# EasyEDA schematic Schematic.json
TITLE: Sheet_1; REV: 1.0; Date: 2023-12-07; Sheet: 1/1; Drawn By: superepicrafter360; Company: Your Company
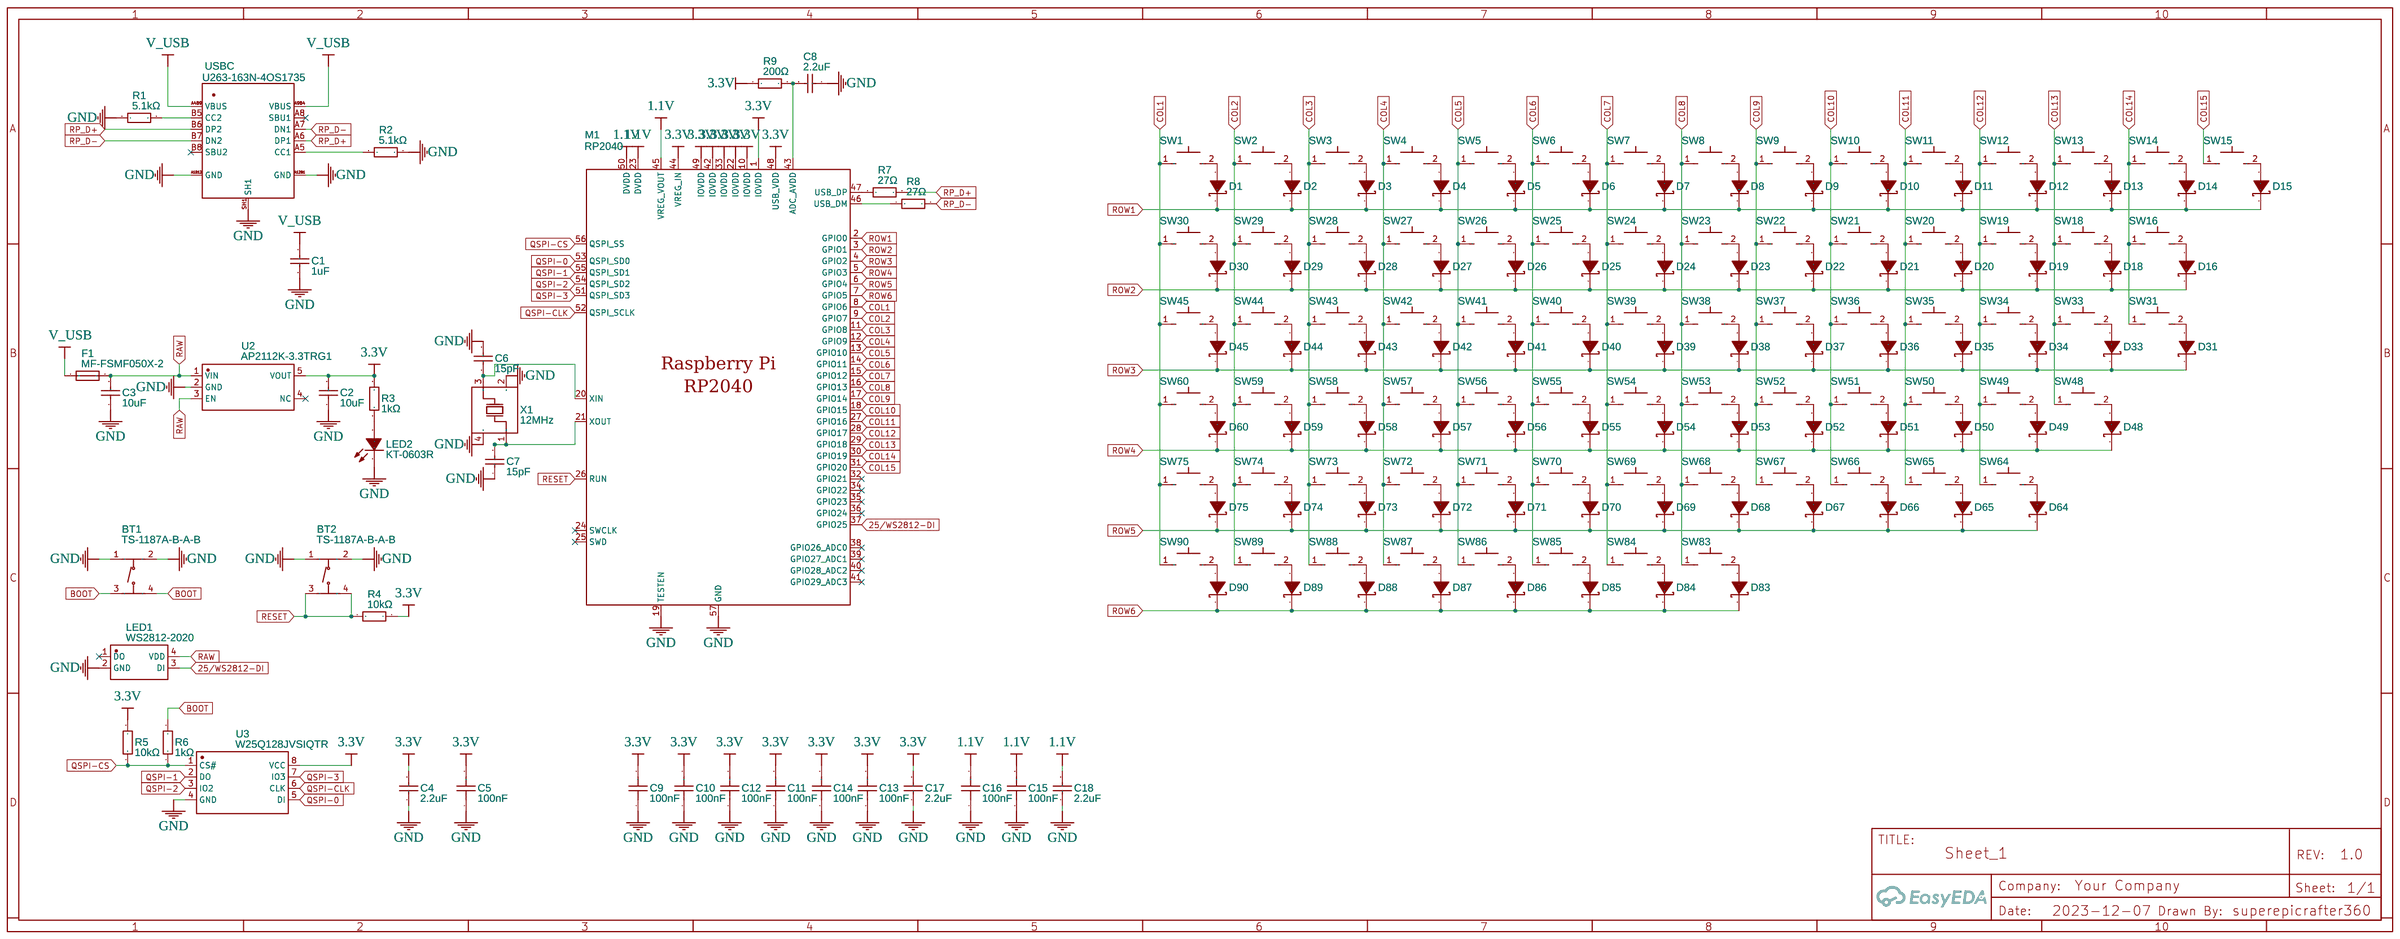
[diagram p0: schematic sheet]

## Parts
BT1  TS-1187A-B-A-B  [SW-SMD_4P-L5.1-W5.1-P3.70-LS6.5-TL-2]
BT2  TS-1187A-B-A-B  [SW-SMD_4P-L5.1-W5.1-P3.70-LS6.5-TL-2]
C1  1uF  [C0603]
C2  10uF  [C1206]
C3  10uF  [C1206]
C4  2.2uF  [C0603]
C5  100nF  [C0603]
C6  15pF  [C0402]
C7  15pF  [C0402]
C8  2.2uF  [C0603]
C9  100nF  [C0603]
C10  100nF  [C0603]
C11  100nF  [C0603]
C12  100nF  [C0603]
C13  100nF  [C0603]
C14  100nF  [C0603]
C15  100nF  [C0603]
C16  100nF  [C0603]
C17  2.2uF  [C0603]
C18  2.2uF  [C0603]
D1  SS210  [SMA_L4.3-W2.6-LS5.2-RD]
D2  SS210  [SMA_L4.3-W2.6-LS5.2-RD]
D3  SS210  [SMA_L4.3-W2.6-LS5.2-RD]
D4  SS210  [SMA_L4.3-W2.6-LS5.2-RD]
D5  SS210  [SMA_L4.3-W2.6-LS5.2-RD]
D6  SS210  [SMA_L4.3-W2.6-LS5.2-RD]
D7  SS210  [SMA_L4.3-W2.6-LS5.2-RD]
D8  SS210  [SMA_L4.3-W2.6-LS5.2-RD]
D9  SS210  [SMA_L4.3-W2.6-LS5.2-RD]
D10  SS210  [SMA_L4.3-W2.6-LS5.2-RD]
D11  SS210  [SMA_L4.3-W2.6-LS5.2-RD]
D12  SS210  [SMA_L4.3-W2.6-LS5.2-RD]
D13  SS210  [SMA_L4.3-W2.6-LS5.2-RD]
D14  SS210  [SMA_L4.3-W2.6-LS5.2-RD]
D15  SS210  [SMA_L4.3-W2.6-LS5.2-RD]
D16  SS210  [SMA_L4.3-W2.6-LS5.2-RD]
D18  SS210  [SMA_L4.3-W2.6-LS5.2-RD]
D19  SS210  [SMA_L4.3-W2.6-LS5.2-RD]
D20  SS210  [SMA_L4.3-W2.6-LS5.2-RD]
D21  SS210  [SMA_L4.3-W2.6-LS5.2-RD]
D22  SS210  [SMA_L4.3-W2.6-LS5.2-RD]
D23  SS210  [SMA_L4.3-W2.6-LS5.2-RD]
D24  SS210  [SMA_L4.3-W2.6-LS5.2-RD]
D25  SS210  [SMA_L4.3-W2.6-LS5.2-RD]
D26  SS210  [SMA_L4.3-W2.6-LS5.2-RD]
D27  SS210  [SMA_L4.3-W2.6-LS5.2-RD]
D28  SS210  [SMA_L4.3-W2.6-LS5.2-RD]
D29  SS210  [SMA_L4.3-W2.6-LS5.2-RD]
D30  SS210  [SMA_L4.3-W2.6-LS5.2-RD]
D31  SS210  [SMA_L4.3-W2.6-LS5.2-RD]
D33  SS210  [SMA_L4.3-W2.6-LS5.2-RD]
D34  SS210  [SMA_L4.3-W2.6-LS5.2-RD]
D35  SS210  [SMA_L4.3-W2.6-LS5.2-RD]
D36  SS210  [SMA_L4.3-W2.6-LS5.2-RD]
D37  SS210  [SMA_L4.3-W2.6-LS5.2-RD]
D38  SS210  [SMA_L4.3-W2.6-LS5.2-RD]
D39  SS210  [SMA_L4.3-W2.6-LS5.2-RD]
D40  SS210  [SMA_L4.3-W2.6-LS5.2-RD]
D41  SS210  [SMA_L4.3-W2.6-LS5.2-RD]
D42  SS210  [SMA_L4.3-W2.6-LS5.2-RD]
D43  SS210  [SMA_L4.3-W2.6-LS5.2-RD]
D44  SS210  [SMA_L4.3-W2.6-LS5.2-RD]
D45  SS210  [SMA_L4.3-W2.6-LS5.2-RD]
D48  SS210  [SMA_L4.3-W2.6-LS5.2-RD]
D49  SS210  [SMA_L4.3-W2.6-LS5.2-RD]
D50  SS210  [SMA_L4.3-W2.6-LS5.2-RD]
D51  SS210  [SMA_L4.3-W2.6-LS5.2-RD]
D52  SS210  [SMA_L4.3-W2.6-LS5.2-RD]
D53  SS210  [SMA_L4.3-W2.6-LS5.2-RD]
D54  SS210  [SMA_L4.3-W2.6-LS5.2-RD]
D55  SS210  [SMA_L4.3-W2.6-LS5.2-RD]
D56  SS210  [SMA_L4.3-W2.6-LS5.2-RD]
D57  SS210  [SMA_L4.3-W2.6-LS5.2-RD]
D58  SS210  [SMA_L4.3-W2.6-LS5.2-RD]
D59  SS210  [SMA_L4.3-W2.6-LS5.2-RD]
D60  SS210  [SMA_L4.3-W2.6-LS5.2-RD]
D64  SS210  [SMA_L4.3-W2.6-LS5.2-RD]
D65  SS210  [SMA_L4.3-W2.6-LS5.2-RD]
D66  SS210  [SMA_L4.3-W2.6-LS5.2-RD]
D67  SS210  [SMA_L4.3-W2.6-LS5.2-RD]
D68  SS210  [SMA_L4.3-W2.6-LS5.2-RD]
D69  SS210  [SMA_L4.3-W2.6-LS5.2-RD]
D70  SS210  [SMA_L4.3-W2.6-LS5.2-RD]
D71  SS210  [SMA_L4.3-W2.6-LS5.2-RD]
D72  SS210  [SMA_L4.3-W2.6-LS5.2-RD]
D73  SS210  [SMA_L4.3-W2.6-LS5.2-RD]
D74  SS210  [SMA_L4.3-W2.6-LS5.2-RD]
D75  SS210  [SMA_L4.3-W2.6-LS5.2-RD]
D83  SS210  [SMA_L4.3-W2.6-LS5.2-RD]
D84  SS210  [SMA_L4.3-W2.6-LS5.2-RD]
D85  SS210  [SMA_L4.3-W2.6-LS5.2-RD]
D86  SS210  [SMA_L4.3-W2.6-LS5.2-RD]
D87  SS210  [SMA_L4.3-W2.6-LS5.2-RD]
D88  SS210  [SMA_L4.3-W2.6-LS5.2-RD]
D89  SS210  [SMA_L4.3-W2.6-LS5.2-RD]
D90  SS210  [SMA_L4.3-W2.6-LS5.2-RD]
F1  MF-FSMF050X-2  [F0603]
LED1  WS2812-2020  [LED-SMD_L2.2-W2.0]
LED2  KT-0603R  [LED0603-RD]
M1  RP2040  [LQFN-56_L7.0-W7.0-P0.4-EP]
R1  5.1kΩ  [R0603]
R2  5.1kΩ  [R0603]
R3  1kΩ  [R0603]
R4  10kΩ  [R0603]
R5  10kΩ  [R0603]
R6  1kΩ  [R0603]
R7  27Ω  [R0603]
R8  27Ω  [R0603]
R9  200Ω  [R0603]
SW1  CPG151101S11-16  [SMD_KEYBOARD-SW]
SW2  CPG151101S11-16  [SMD_KEYBOARD-SW]
SW3  CPG151101S11-16  [SMD_KEYBOARD-SW]
SW4  CPG151101S11-16  [SMD_KEYBOARD-SW]
SW5  CPG151101S11-16  [SMD_KEYBOARD-SW]
SW6  CPG151101S11-16  [SMD_KEYBOARD-SW]
SW7  CPG151101S11-16  [SMD_KEYBOARD-SW]
SW8  CPG151101S11-16  [SMD_KEYBOARD-SW]
SW9  CPG151101S11-16  [SMD_KEYBOARD-SW]
SW10  CPG151101S11-16  [SMD_KEYBOARD-SW]
SW11  CPG151101S11-16  [SMD_KEYBOARD-SW]
SW12  CPG151101S11-16  [SMD_KEYBOARD-SW]
SW13  CPG151101S11-16  [SMD_KEYBOARD-SW]
SW14  CPG151101S11-16  [SMD_KEYBOARD-SW]
SW15  CPG151101S11-16  [SMD_KEYBOARD-SW]
SW16  CPG151101S11-16  [SMD_KEYBOARD-SW]
SW18  CPG151101S11-16  [SMD_KEYBOARD-SW]
SW19  CPG151101S11-16  [SMD_KEYBOARD-SW]
SW20  CPG151101S11-16  [SMD_KEYBOARD-SW]
SW21  CPG151101S11-16  [SMD_KEYBOARD-SW]
SW22  CPG151101S11-16  [SMD_KEYBOARD-SW]
SW23  CPG151101S11-16  [SMD_KEYBOARD-SW]
SW24  CPG151101S11-16  [SMD_KEYBOARD-SW]
SW25  CPG151101S11-16  [SMD_KEYBOARD-SW]
SW26  CPG151101S11-16  [SMD_KEYBOARD-SW]
SW27  CPG151101S11-16  [SMD_KEYBOARD-SW]
SW28  CPG151101S11-16  [SMD_KEYBOARD-SW]
SW29  CPG151101S11-16  [SMD_KEYBOARD-SW]
SW30  CPG151101S11-16  [SMD_KEYBOARD-SW]
SW31  CPG151101S11-16  [SMD_KEYBOARD-SW]
SW33  CPG151101S11-16  [SMD_KEYBOARD-SW]
SW34  CPG151101S11-16  [SMD_KEYBOARD-SW]
SW35  CPG151101S11-16  [SMD_KEYBOARD-SW]
SW36  CPG151101S11-16  [SMD_KEYBOARD-SW]
SW37  CPG151101S11-16  [SMD_KEYBOARD-SW]
SW38  CPG151101S11-16  [SMD_KEYBOARD-SW]
SW39  CPG151101S11-16  [SMD_KEYBOARD-SW]
SW40  CPG151101S11-16  [SMD_KEYBOARD-SW]
SW41  CPG151101S11-16  [SMD_KEYBOARD-SW]
SW42  CPG151101S11-16  [SMD_KEYBOARD-SW]
SW43  CPG151101S11-16  [SMD_KEYBOARD-SW]
SW44  CPG151101S11-16  [SMD_KEYBOARD-SW]
SW45  CPG151101S11-16  [SMD_KEYBOARD-SW]
SW48  CPG151101S11-16  [SMD_KEYBOARD-SW]
SW49  CPG151101S11-16  [SMD_KEYBOARD-SW]
SW50  CPG151101S11-16  [SMD_KEYBOARD-SW]
SW51  CPG151101S11-16  [SMD_KEYBOARD-SW]
SW52  CPG151101S11-16  [SMD_KEYBOARD-SW]
SW53  CPG151101S11-16  [SMD_KEYBOARD-SW]
SW54  CPG151101S11-16  [SMD_KEYBOARD-SW]
SW55  CPG151101S11-16  [SMD_KEYBOARD-SW]
SW56  CPG151101S11-16  [SMD_KEYBOARD-SW]
SW57  CPG151101S11-16  [SMD_KEYBOARD-SW]
SW58  CPG151101S11-16  [SMD_KEYBOARD-SW]
SW59  CPG151101S11-16  [SMD_KEYBOARD-SW]
SW60  CPG151101S11-16  [SMD_KEYBOARD-SW]
SW64  CPG151101S11-16  [SMD_KEYBOARD-SW]
SW65  CPG151101S11-16  [SMD_KEYBOARD-SW]
SW66  CPG151101S11-16  [SMD_KEYBOARD-SW]
SW67  CPG151101S11-16  [SMD_KEYBOARD-SW]
SW68  CPG151101S11-16  [SMD_KEYBOARD-SW]
SW69  CPG151101S11-16  [SMD_KEYBOARD-SW]
SW70  CPG151101S11-16  [SMD_KEYBOARD-SW]
SW71  CPG151101S11-16  [SMD_KEYBOARD-SW]
SW72  CPG151101S11-16  [SMD_KEYBOARD-SW]
SW73  CPG151101S11-16  [SMD_KEYBOARD-SW]
SW74  CPG151101S11-16  [SMD_KEYBOARD-SW]
SW75  CPG151101S11-16  [SMD_KEYBOARD-SW]
SW83  CPG151101S11-16  [SMD_KEYBOARD-SW]
SW84  CPG151101S11-16  [SMD_KEYBOARD-SW]
SW85  CPG151101S11-16  [SMD_KEYBOARD-SW]
SW86  CPG151101S11-16  [SMD_KEYBOARD-SW]
SW87  CPG151101S11-16  [SMD_KEYBOARD-SW]
SW88  CPG151101S11-16  [SMD_KEYBOARD-SW]
SW89  CPG151101S11-16  [SMD_KEYBOARD-SW]
SW90  CPG151101S11-16  [SMD_KEYBOARD-SW]
U2  AP2112K-3.3TRG1  [SOT-25-5_L2.9-W1.6-P0.95-LS2.8-BL]
U3  W25Q128JVSIQTR  [SOIC-8_L5.3-W5.3-P1.27-LS8.0-BL]
USBC  U263-163N-4OS1735  [USB-C-SMD_U263-163N-4GS1735]
X1  12MHz  [OSC-SMD_4P-L3.2-W2.5-BL]

## Library data of the parts
BT1 BT2 = TS-1187A-B-A-B: Contributor: LCSC; Supplier: LCSC; Supplier Part: C318884; Manufacturer: XKB Connectivity(中国星坤); JLCPCB Part Class: Basic Part; link: https://lcsc.com/eda_search?q=C318884&%26type=1&ref=editor
C1 = CL10A105KB8NNNC: Supplier: LCSC; Manufacturer: SAMSUNG(三星); Supplier Part: C15849; JLCPCB Part Class: Basic Part; link: https://lcsc.com/eda_search?q=C15849&%26type=1&ref=editor
C2 C3 = CL31A106KBHNNNE: Supplier: LCSC; Manufacturer: SAMSUNG(三星); Supplier Part: C13585; JLCPCB Part Class: Basic Part; link: https://lcsc.com/eda_search?q=C13585&%26type=1&ref=editor
C4 C8 C17 C18 = CL10A225KO8NNNC: Supplier: LCSC; Manufacturer: SAMSUNG(三星); Supplier Part: C23630; JLCPCB Part Class: Basic Part; link: https://lcsc.com/eda_search?q=C23630&%26type=1&ref=editor
C5 C9-C16 = CC0603KRX7R9BB104: Supplier: LCSC; Manufacturer: YAGEO(国巨); Supplier Part: C14663; JLCPCB Part Class: Basic Part; link: https://lcsc.com/eda_search?q=C14663&%26type=1&ref=editor
C6 C7 = 0402CG150J500NT: Supplier: LCSC; Manufacturer: FH(风华); Supplier Part: C1548; JLCPCB Part Class: Basic Part; link: https://lcsc.com/eda_search?q=C1548&%26type=1&ref=editor
D1-D16 D18-D31 D33-D45 D48-D60 D64-D75 D83-D90 = SS210: Supplier: LCSC; Manufacturer: MDD; Supplier Part: C14996; JLCPCB Part Class: Basic Part; link: https://lcsc.com/eda_search?q=C14996&%26type=1&ref=editor
F1 = MF-FSMF050X-2: Contributor: LCSC; Supplier: LCSC; Supplier Part: C210357; Manufacturer: BOURNS; JLCPCB Part Class: Extended Part; link: https://lcsc.com/eda_search?q=C210357&%26type=1&ref=editor
LED1 = WS2812-2020: Contributor: LCSC; Supplier: LCSC; Supplier Part: C9900007650; Manufacturer: null; JLCPCB Part Class: Extended Part; link: https://lcsc.com/eda_search?q=C9900007650&%26type=1&ref=editor
LED2 = KT-0603R: Supplier: LCSC; Manufacturer: KENTO; Supplier Part: C2286; JLCPCB Part Class: Basic Part; link: https://lcsc.com/eda_search?q=C2286&%26type=1&ref=editor
M1 = RP2040: Contributor: LCSC; Supplier: LCSC; Supplier Part: C2040; Manufacturer: Raspberry Pi(树莓派); JLCPCB Part Class: Extended Part; link: https://lcsc.com/eda_search?q=C2040&%26type=1&ref=editor
R1 R2 = 0603WAF5101T5E: Supplier: LCSC; Manufacturer: UNI-ROYAL(厚声); Supplier Part: C23186; JLCPCB Part Class: Basic Part; link: https://lcsc.com/eda_search?q=C23186&%26type=1&ref=editor
R3 R6 = 0603WAF1001T5E: Supplier: LCSC; Manufacturer: UNI-ROYAL(厚声); Supplier Part: C21190; JLCPCB Part Class: Basic Part; link: https://lcsc.com/eda_search?q=C21190&%26type=1&ref=editor
R4 R5 = 0603WAF1002T5E: Supplier: LCSC; Manufacturer: UNI-ROYAL(厚声); Supplier Part: C25804; JLCPCB Part Class: Basic Part; link: https://lcsc.com/eda_search?q=C25804&%26type=1&ref=editor
R7 R8 = 0603WAF270JT5E: Supplier: LCSC; Manufacturer: UNI-ROYAL(厚声); Supplier Part: C25190; JLCPCB Part Class: Basic Part; link: https://lcsc.com/eda_search?q=C25190&%26type=1&ref=editor
R9 = 0603WAF2000T5E: Supplier: LCSC; Manufacturer: UNI-ROYAL(厚声); Supplier Part: C8218; JLCPCB Part Class: Basic Part; link: https://lcsc.com/eda_search?q=C8218&%26type=1&ref=editor
SW1-SW16 SW18-SW31 SW33-SW45 SW48-SW60 SW64-SW75 SW83-SW90 = CPG151101S11-16: Contributor: lcsc; Supplier: LCSC; Supplier Part: C5156480; Manufacturer: Kailh(凯华); JLCPCB Part Class: Extended Part; link: https://lcsc.com/eda_search?q=C5156480&%26type=1&ref=editor
U2 = AP2112K-3.3TRG1: Contributor: LCSC; Supplier: LCSC; Manufacturer: DIODES(美台); Supplier Part: C51118; JLCPCB Part Class: Extended Part; link: https://lcsc.com/eda_search?q=C51118&%26type=1&ref=editor
U3 = W25Q128JVSIQTR: Supplier: LCSC; Manufacturer: WINBOND(华邦); Manufacturer Part: W25Q128JVSIQ; Supplier Part: C97521; JLCPCB Part Class: Basic Part; link: https://lcsc.com/eda_search?q=C97521&%26type=1&ref=editor
USBC = U263-163N-4OS1735: Contributor: lcsc; Supplier: LCSC; Supplier Part: C2931472; Manufacturer: XKB Connectivity(中国星坤); JLCPCB Part Class: Extended Part; link: https://lcsc.com/eda_search?q=C2931472&%26type=1&ref=editor
X1 = X322512MSB4SI: Supplier: LCSC; Manufacturer: YXC(扬兴晶振); Supplier Part: C9002; JLCPCB Part Class: Basic Part; link: https://lcsc.com/eda_search?q=C9002&%26type=1&ref=editor

## Nets
1.1V: C15.2 C16.2 C18.2 M1.23(DVDD) M1.45(VREG_VOUT) M1.50(DVDD)
3.3V: C2.2 C4.2 C5.2 C9.2 C10.2 C11.2 C12.2 C13.2 C14.2 C17.2 M1.1(IOVDD) M1.10(IOVDD) M1.22(IOVDD) M1.33(IOVDD) M1.42(IOVDD) M1.44(VREG_IN) M1.48(USB_VDD) M1.49(IOVDD) R3.2 R4.2 R5.2 R9.1 U2.5(VOUT) U3.8(VCC)
GND: BT1.1(A) BT1.2(B) BT2.1(A) BT2.2(B) C1.1 C2.1 C3.1 C4.1 C5.1 C6.2 C7.1 C8.1 C9.1 C10.1 C11.1 C12.1 C13.1 C14.1 C15.1 C16.1 C17.1 C18.1 LED1.2(GND) LED2.1(K) M1.19(TESTEN) M1.57(GND) R1.1 R2.1 U2.2(GND) U3.4(GND) USBC.A1B12(GND) USBC.A12B1(GND) USBC.SH1 X1.2(GND) X1.4(GND)
25/WS2812-DI: LED1.3(DI) M1.37(GPIO25)
BOOT: BT1.3(C) BT1.4(D) R6.2
COL1: M1.8(GPIO6) SW1.1 SW30.1 SW45.1 SW60.1 SW75.1 SW90.1
COL2: M1.9(GPIO7) SW2.1 SW29.1 SW44.1 SW59.1 SW74.1 SW89.1
COL3: M1.11(GPIO8) SW3.1 SW28.1 SW43.1 SW58.1 SW73.1 SW88.1
COL4: M1.12(GPIO9) SW4.1 SW27.1 SW42.1 SW57.1 SW72.1 SW87.1
COL5: M1.13(GPIO10) SW5.1 SW26.1 SW41.1 SW56.1 SW71.1 SW86.1
COL6: M1.14(GPIO11) SW6.1 SW25.1 SW40.1 SW55.1 SW70.1 SW85.1
COL7: M1.15(GPIO12) SW7.1 SW24.1 SW39.1 SW54.1 SW69.1 SW84.1
COL8: M1.16(GPIO13) SW8.1 SW23.1 SW38.1 SW53.1 SW68.1 SW83.1
COL9: M1.17(GPIO14) SW9.1 SW22.1 SW37.1 SW52.1 SW67.1
COL10: M1.18(GPIO15) SW10.1 SW21.1 SW36.1 SW51.1 SW66.1
COL11: M1.27(GPIO16) SW11.1 SW20.1 SW35.1 SW50.1 SW65.1
COL12: M1.28(GPIO17) SW12.1 SW19.1 SW34.1 SW49.1 SW64.1
COL13: M1.29(GPIO18) SW13.1 SW18.1 SW33.1 SW48.1
COL14: M1.30(GPIO19) SW14.1 SW16.1 SW31.1
COL15: M1.31(GPIO20) SW15.1
QSPI-0: M1.53(QSPI_SD0) U3.5(DI)
QSPI-1: M1.55(QSPI_SD1) U3.2(DO)
QSPI-2: M1.54(QSPI_SD2) U3.3(IO2)
QSPI-3: M1.51(QSPI_SD3) U3.7(IO3)
QSPI-CLK: M1.52(QSPI_SCLK) U3.6(CLK)
QSPI-CS: M1.56(QSPI_SS) R5.1 R6.1 U3.1(CS#)
RAW: C3.2 F1.2 LED1.4(VDD) U2.1(VIN) U2.3(EN)
RESET: BT2.3(C) BT2.4(D) M1.26(RUN) R4.1
ROW1: D1.1(K) D2.1(K) D3.1(K) D4.1(K) D5.1(K) D6.1(K) D7.1(K) D8.1(K) D9.1(K) D10.1(K) D11.1(K) D12.1(K) D13.1(K) D14.1(K) D15.1(K) M1.2(GPIO0)
ROW2: D16.1(K) D18.1(K) D19.1(K) D20.1(K) D21.1(K) D22.1(K) D23.1(K) D24.1(K) D25.1(K) D26.1(K) D27.1(K) D28.1(K) D29.1(K) D30.1(K) M1.3(GPIO1)
ROW3: D31.1(K) D33.1(K) D34.1(K) D35.1(K) D36.1(K) D37.1(K) D38.1(K) D39.1(K) D40.1(K) D41.1(K) D42.1(K) D43.1(K) D44.1(K) D45.1(K) M1.4(GPIO2)
ROW4: D48.1(K) D49.1(K) D50.1(K) D51.1(K) D52.1(K) D53.1(K) D54.1(K) D55.1(K) D56.1(K) D57.1(K) D58.1(K) D59.1(K) D60.1(K) M1.5(GPIO3)
ROW5: D64.1(K) D65.1(K) D66.1(K) D67.1(K) D68.1(K) D69.1(K) D70.1(K) D71.1(K) D72.1(K) D73.1(K) D74.1(K) D75.1(K) M1.6(GPIO4)
ROW6: D83.1(K) D84.1(K) D85.1(K) D86.1(K) D87.1(K) D88.1(K) D89.1(K) D90.1(K) M1.7(GPIO5)
RP_D+: R7.2 USBC.A6(DP1) USBC.B6(DP2)
RP_D-: R8.2 USBC.A7(DN1) USBC.B7(DN2)
V_USB: C1.2 F1.1 USBC.A4B9(VBUS) USBC.A9B4(VBUS)
Net-(C6-1): C6.1 M1.20(XIN) X1.3(OSC2)
Net-(C7-2): C7.2 M1.21(XOUT) X1.1(OSC1)
Net-(C8-2): C8.2 M1.43(ADC_AVDD) R9.2
Net-(D1-2): D1.2(A) SW1.2
Net-(D2-2): D2.2(A) SW2.2
Net-(D3-2): D3.2(A) SW3.2
Net-(D4-2): D4.2(A) SW4.2
Net-(D5-2): D5.2(A) SW5.2
Net-(D6-2): D6.2(A) SW6.2
Net-(D7-2): D7.2(A) SW7.2
Net-(D8-2): D8.2(A) SW8.2
Net-(D9-2): D9.2(A) SW9.2
Net-(D10-2): D10.2(A) SW10.2
Net-(D11-2): D11.2(A) SW11.2
Net-(D12-2): D12.2(A) SW12.2
Net-(D13-2): D13.2(A) SW13.2
Net-(D14-2): D14.2(A) SW14.2
Net-(D15-2): D15.2(A) SW15.2
Net-(D16-2): D16.2(A) SW16.2
Net-(D18-2): D18.2(A) SW18.2
Net-(D19-2): D19.2(A) SW19.2
Net-(D20-2): D20.2(A) SW20.2
Net-(D21-2): D21.2(A) SW21.2
Net-(D22-2): D22.2(A) SW22.2
Net-(D23-2): D23.2(A) SW23.2
Net-(D24-2): D24.2(A) SW24.2
Net-(D25-2): D25.2(A) SW25.2
Net-(D26-2): D26.2(A) SW26.2
Net-(D27-2): D27.2(A) SW27.2
Net-(D28-2): D28.2(A) SW28.2
Net-(D29-2): D29.2(A) SW29.2
Net-(D30-2): D30.2(A) SW30.2
Net-(D31-2): D31.2(A) SW31.2
Net-(D33-2): D33.2(A) SW33.2
Net-(D34-2): D34.2(A) SW34.2
Net-(D35-2): D35.2(A) SW35.2
Net-(D36-2): D36.2(A) SW36.2
Net-(D37-2): D37.2(A) SW37.2
Net-(D38-2): D38.2(A) SW38.2
Net-(D39-2): D39.2(A) SW39.2
Net-(D40-2): D40.2(A) SW40.2
Net-(D41-2): D41.2(A) SW41.2
Net-(D42-2): D42.2(A) SW42.2
Net-(D43-2): D43.2(A) SW43.2
Net-(D44-2): D44.2(A) SW44.2
Net-(D45-2): D45.2(A) SW45.2
Net-(D48-2): D48.2(A) SW48.2
Net-(D49-2): D49.2(A) SW49.2
Net-(D50-2): D50.2(A) SW50.2
Net-(D51-2): D51.2(A) SW51.2
Net-(D52-2): D52.2(A) SW52.2
Net-(D53-2): D53.2(A) SW53.2
Net-(D54-2): D54.2(A) SW54.2
Net-(D55-2): D55.2(A) SW55.2
Net-(D56-2): D56.2(A) SW56.2
Net-(D57-2): D57.2(A) SW57.2
Net-(D58-2): D58.2(A) SW58.2
Net-(D59-2): D59.2(A) SW59.2
Net-(D60-2): D60.2(A) SW60.2
Net-(D64-2): D64.2(A) SW64.2
Net-(D65-2): D65.2(A) SW65.2
Net-(D66-2): D66.2(A) SW66.2
Net-(D67-2): D67.2(A) SW67.2
Net-(D68-2): D68.2(A) SW68.2
Net-(D69-2): D69.2(A) SW69.2
Net-(D70-2): D70.2(A) SW70.2
Net-(D71-2): D71.2(A) SW71.2
Net-(D72-2): D72.2(A) SW72.2
Net-(D73-2): D73.2(A) SW73.2
Net-(D74-2): D74.2(A) SW74.2
Net-(D75-2): D75.2(A) SW75.2
Net-(D83-2): D83.2(A) SW83.2
Net-(D84-2): D84.2(A) SW84.2
Net-(D85-2): D85.2(A) SW85.2
Net-(D86-2): D86.2(A) SW86.2
Net-(D87-2): D87.2(A) SW87.2
Net-(D88-2): D88.2(A) SW88.2
Net-(D89-2): D89.2(A) SW89.2
Net-(D90-2): D90.2(A) SW90.2
Net-(LED2-2): LED2.2(A) R3.1
Net-(M1-46): M1.46(USB_DM) R8.1
Net-(M1-47): M1.47(USB_DP) R7.1
Net-(R1-2): R1.2 USBC.B5(CC2)
Net-(R2-2): R2.2 USBC.A5(CC1)

Not connected (* = marked no-connect by the designer): LED1 1(DO)*; M1 24(SWCLK)* 25(SWD)* 32(GPIO21)* 34(GPIO22)* 35(GPIO23)* 36(GPIO24)* 38(GPIO26_ADC0)* 39(GPIO27_ADC1)* 40(GPIO28_ADC2)* 41(GPIO29_ADC3)*; U2 4(NC)*; USBC A8(SBU1)* B8(SBU2)*
